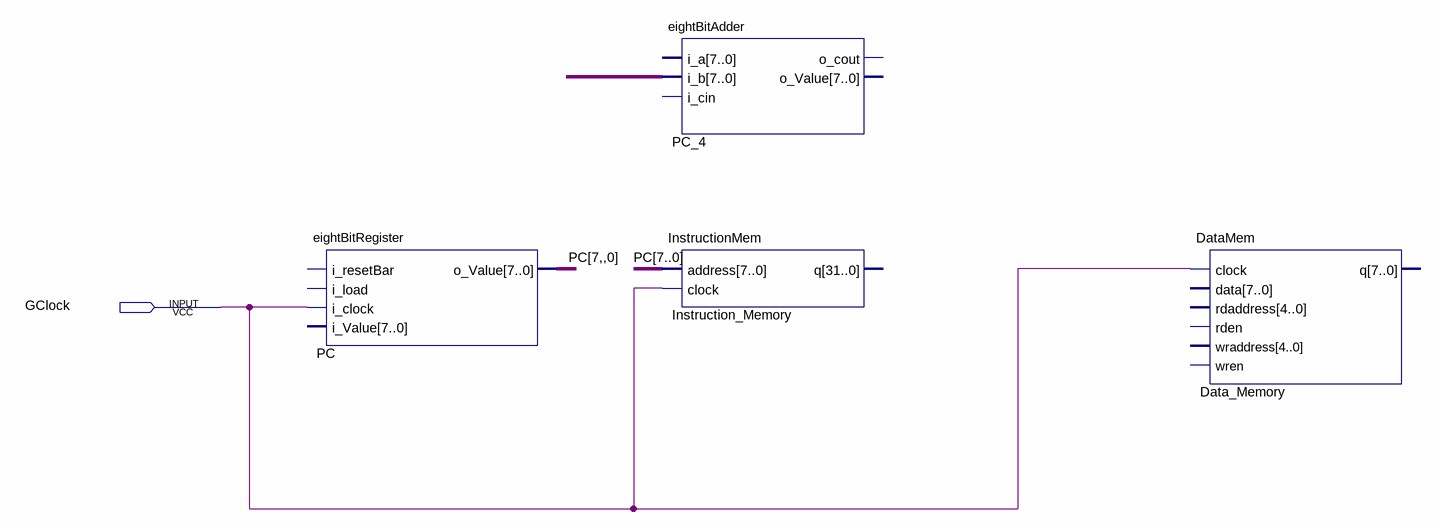
[diagram p0: schematic sheet]
// Quartus schematic TopLevel.bdf as structural Verilog: 4 symbols, 1 pins
module TopLevel (
  input  GClock
);

  wire [7:0] PC, PC_o_value, undriven;

  eightBitRegister u_PC (.i_clock(GClock), .o_Value(PC_o_value));  // open: i_resetBar, i_load, i_Value
  eightBitAdder PC_4 (.i_b(undriven));  // open: i_a, i_cin, o_cout, o_Value
  InstructionMem Instruction_Memory (.address(PC), .clock(GClock));  // open: q
  DataMem Data_Memory (.clock(GClock));  // open: data, rdaddress, rden, wraddress, wren, q
endmodule
